# EAGLE design relay_dip_v01 (EAGLE 6.5.0)
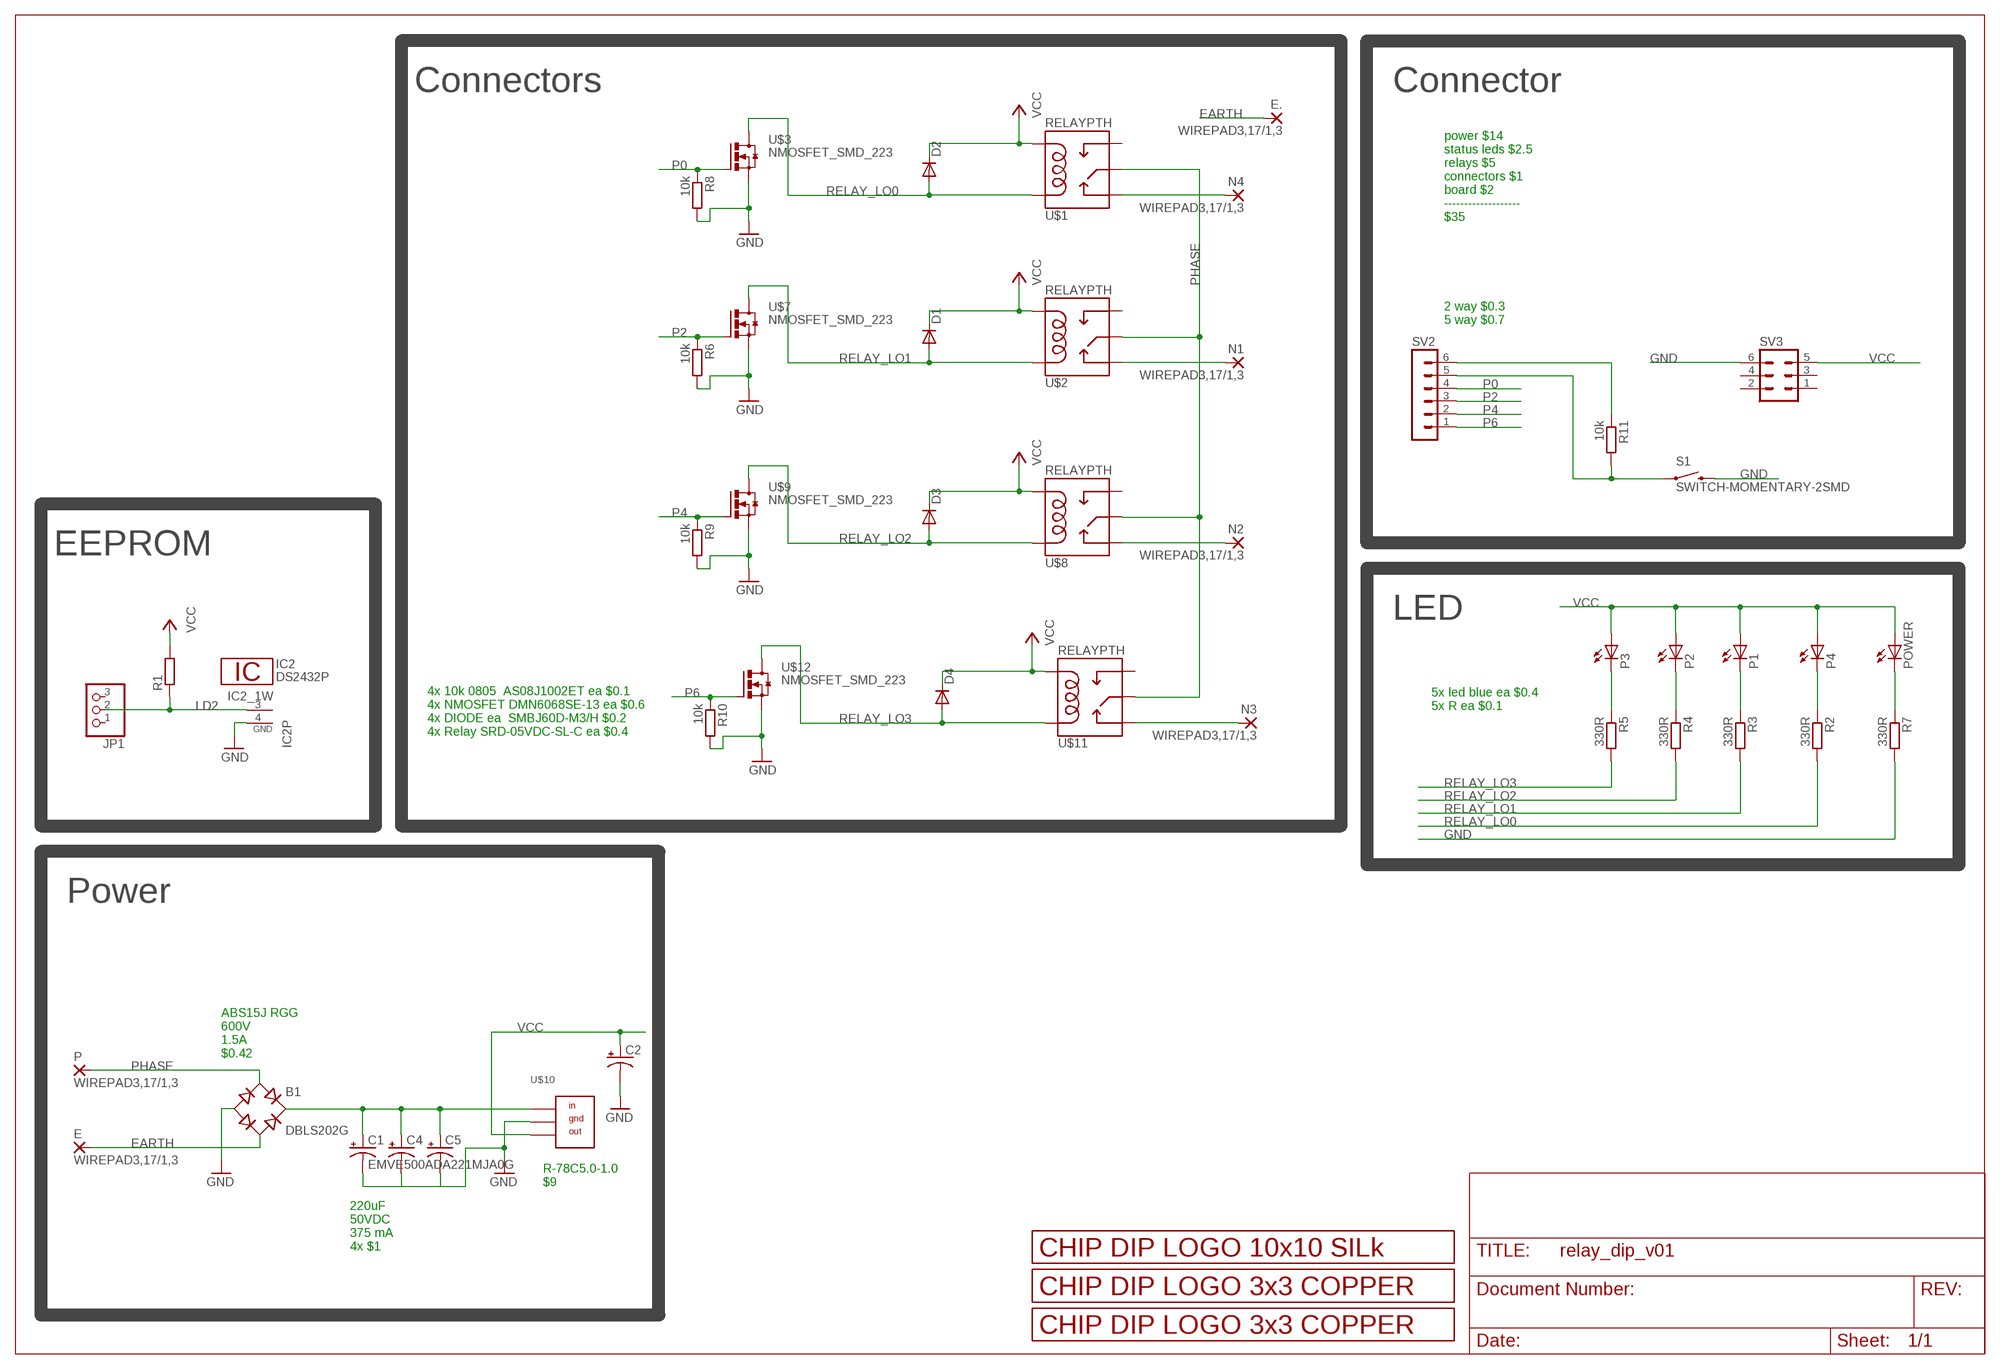
[diagram p0: schematic, sheet 1]

## Parts
B1  DBLS202G  [DBS]
C1  EMVE500ADA221MJA0G  CPOL-US150CLZ-0810  [150CLZ-0810]
C2  CPOL-US150CLZ-0810  [150CLZ-0810]
C4  CPOL-US150CLZ-0810  [150CLZ-0810]
C5  CPOL-US150CLZ-0810  [150CLZ-0810]
D1  DIODE-SMB  [SMB]
D2  DIODE-SMB  [SMB]
D3  DIODE-SMB  [SMB]
D4  DIODE-SMB  [SMB]
E  WIREPAD3,17/1,3  [3,17/1,3]
E.  WIREPAD3,17/1,3  [3,17/1,3]
IC2  DS2432P  [TSOC6]
JP1  PINHD-1X3  [1X03]
N1  WIREPAD3,17/1,3  [3,17/1,3]
N2  WIREPAD3,17/1,3  [3,17/1,3]
N3  WIREPAD3,17/1,3  [3,17/1,3]
N4  WIREPAD3,17/1,3  [3,17/1,3]
P  WIREPAD3,17/1,3  [3,17/1,3]
P1  LEDCHIP-LED0805  [CHIP-LED0805]
P2  LEDCHIP-LED0805  [CHIP-LED0805]
P3  LEDCHIP-LED0805  [CHIP-LED0805]
P4  LEDCHIP-LED0805  [CHIP-LED0805]
POWER  LEDCHIP-LED0805  [CHIP-LED0805]
R1  R-EU_R0805  [R0805]
R2  330R  R-EU_R0805  [R0805]
R3  330R  R-EU_R0805  [R0805]
R4  330R  R-EU_R0805  [R0805]
R5  330R  R-EU_R0805  [R0805]
R6  10k  R-EU_R0805  [R0805]
R7  330R  R-EU_R0805  [R0805]
R8  10k  R-EU_R0805  [R0805]
R9  10k  R-EU_R0805  [R0805]
R10  10k  R-EU_R0805  [R0805]
R11  10k  R-EU_R0805  [R0805]
S1  SWITCH-MOMENTARY-2SMD  [TACTILE-SWITCH-SMD]
SV2  MA06-1  [MA06-1]
SV3  MA03-2  [MA03-2]
U$1  RELAYPTH  [SRD-05VDC-SL-C]
U$2  RELAYPTH  [SRD-05VDC-SL-C]
U$3  NMOSFET_SMD_223  [SOT223]
U$4  LOGO_3X3_COPPER  [LOGO_3X3_COPPER]
U$5  LOGO_10X10_SILK  [LOGO_10X10_SILK]
U$6  LOGO_3X3_COPPER  [LOGO_3X3_COPPER]
U$7  NMOSFET_SMD_223  [SOT223]
U$8  RELAYPTH  [SRD-05VDC-SL-C]
U$9  NMOSFET_SMD_223  [SOT223]
U$10  R-7805-1.0  [SIP3]
U$11  RELAYPTH  [SRD-05VDC-SL-C]
U$12  NMOSFET_SMD_223  [SOT223]

## Nets
EARTH: B1.AC2 E.1(P) E..1(P)
GND: B1.- C1.- C2.- C4.- C5.- IC2.4(GND) R6.2 R7.2 R8.2 R9.2 R10.2 S1.3 SV3.6 U$3.3(S) U$7.3(S) U$9.3(S) U$10.GND U$12.3(S)
LD2: IC2.3(1W) JP1.2 R1.1
N$1: R11.2 S1.1 SV2.5
N$3: P4.C R2.1
N$4: P1.C R3.1
N$5: B1.+ C1.+ C4.+ C5.+ U$10.IN
N$6: R11.1 SV2.6
N$8: P2.C R4.1
N$10: P3.C R5.1
N$29: POWER.C R7.1
NCL: N4.1(P) U$1.SWCLOSED(SWCLOSE)
NCL1: N1.1(P) U$2.SWCLOSED(SWCLOSE)
NCL2: N2.1(P) U$8.SWCLOSED(SWCLOSE)
NCL3: N3.1(P) U$11.SWCLOSED(SWCLOSE)
P0: R8.1 SV2.4 U$3.1(G)
P2: R6.1 SV2.3 U$7.1(G)
P4: R9.1 SV2.2 U$9.1(G)
P6: R10.1 SV2.1 U$12.1(G)
PHASE: B1.AC1 P.1(P) U$1.SWCOMMON U$2.SWCOMMON U$8.SWCOMMON U$11.SWCOMMON
RELAY_LO0: D2.A R2.2 U$1.COIL1 U$3.2(D) U$3.4(D)
RELAY_LO1: D1.A R3.2 U$2.COIL1 U$7.2(D) U$7.4(D)
RELAY_LO2: D3.A R4.2 U$8.COIL1 U$9.2(D) U$9.4(D)
RELAY_LO3: D4.A R5.2 U$11.COIL1 U$12.2(D) U$12.4(D)
VCC: C2.+ D1.C D2.C D3.C D4.C P1.A P2.A P3.A P4.A POWER.A R1.2 SV3.5 U$1.COIL0 U$2.COIL0 U$8.COIL0 U$10.OUT U$11.COIL0
Unconnected: JP1.1 JP1.3 SV3.1 SV3.2 SV3.3 SV3.4 U$1.SWOPEN U$2.SWOPEN U$8.SWOPEN U$11.SWOPEN

## Notes on the sheet
- Connectors | Connector
- power $14
  status leds $2.5
  relays $5
  connectors $1
  board $2
  -------------------
  $35
- 2 way $0.3
  5 way $0.7
- EEPROM
- LED
- 5x led blue ea $0.4
  5x R ea $0.1
- 4x 10k 0805  AS08J1002ET ea $0.1
  4x NMOSFET DMN6068SE-13 ea $0.6
  4x DIODE ea  SMBJ60D-M3/H $0.2
  4x Relay SRD-05VDC-SL-C ea $0.4
- Power
- ABS15J RGG
  600V
  1.5A
  $0.42
- R-78C5.0-1.0
  $9
- 220uF
  50VDC
  375 mA
  4x $1

## Library data of the parts
B1 = rectifier:DB?*G: Single Phase 1.0 AMP Glass Passivated Bridge Rectifier Taiwan Semiconductor Co.,Ltd. - TSC Source: http://www.taiwansemi.com/TSCbig5/ezcatfiles/cust/img/img/db101g.pdf http://www.ts.com.tw/db/pictures/modules/PDT/PDT060207001/DBLS201G.pdf
C1 C2 C4 C5 = rcl:CPOL-US: POLARIZED CAPACITOR, American symbol
D1-D4 = diode:DIODE-: DIODE
E E. N1-N4 P = wirepad:WIREPAD: Wire PAD connect wire on PCB
IC2 = 1wire:DS2432: 1024-Bit Protected EEPROM with SHA-1 Engine This chip is a cryptographic device, providing 1024 Bits of EEPROM memory which may be written only after supplying the correct 64 bit secret. the secret cannot be read back from the device. The other features of this chip are like the DS2431. Please note the SHA-1 hash algorithm is considered weak if the data is not properly "padded". If you don't understand anything of this, don't use this chip. Author: Jan Kandziora <jjj@gmx.de>
JP1 = adafruit:PINHD-1X3: PIN HEADER
P1-P4 POWER = led:LED: LED OSRAM: - CHIPLED LG R971, LG N971, LY N971, LG Q971, LY Q971, LO R971, LY R971 LH N974, LH R974 LS Q976, LO Q976, LY Q976 LO Q996 - Hyper CHIPLED LW Q18S LB Q993, LB Q99A, LB R99A - SideLED LS A670, LO A670, LY A670, LG A670, LP A670 LB A673, LV A673, LT A673, LW A673 LH A674 LY A675 LS A676, LA A676, LO A676, LY A676, LW A676 LS A679, LY A679, LG A679 - Hyper Micro SIDELED® LS Y876, LA Y876, LO Y876, LY Y876 LT Y87S - SmartLED LW L88C, LW L88S LB L89C, LB L89S, LG L890 LS L89K, LO L89K, LY L89K LS L896, LA L896, LO L896, LY L896 - TOPLED LS T670, LO T670, LY T670, LG T670, LP T670 LSG T670, LSP T670, LSY T670, LOP T670, LYG T670 LG T671, LOG T671, LSG T671 LB T673, LV T673, LT T673, LW T673 LH T674 LS T676, LA T676, LO T676, LY T676, LB T676, LH T676, LSB T676, LW T676 LB T67C, LV T67C, LT T67C, LS T67K, LO T67K, LY T67K, LW E67C LS E67B, LA E67B, LO E67B, LY E67B, LB E67C, LV E67C, LT E67C LW T67C LS T679, LY T679, LG T679 LS T770, LO T770, LY T770, LG T770, LP T770 LB T773, LV T773, LT T773, LW T773 LH T774 LS E675, LA E675, LY E675, LS T675 LS T776, LA T776, LO T776, LY T776, LB T776 LHGB T686 LT T68C, LB T68C - Hyper Mini TOPLED® LB M676 - Mini TOPLED Santana® LG M470 LS M47K, LO M47K, LY M47K Source: http://www.osram.convergy.de LUXEON: - LUMILED® LXK2-PW12-R00, LXK2-PW12-S00, LXK2-PW14-U00, LXK2-PW14-V00 LXK2-PM12-R00, LXK2-PM12-S00, LXK2-PM14-U00 LXK2-PE12-Q00, LXK2-PE12-R00, LXK2-PE12-S00, LXK2-PE14-T00, LXK2-PE14-U00 LXK2-PB12-K00, LXK2-PB12-L00, LXK2-PB12-M00, LXK2-PB14-N00, LXK2-PB14-P00, LXK2-PB14-Q00 LXK2-PR12-L00, LXK2-PR12-M00, LXK2-PR14-Q00, LXK2-PR14-R00 LXK2-PD12-Q00, LXK2-PD12-R00, LXK2-PD12-S00 LXK2-PH12-R00, LXK2-PH12-S00 LXK2-PL12-P00, LXK2-PL12-Q00, LXK2-PL12-R00 Source: www.luxeon.com KINGBRIGHT: KA-3528ASYC Source: www.kingbright.com
R1-R11 = rcl:R-EU_: RESISTOR, European symbol
S1 = SparkFun-Electromechanical:SWITCH-MOMENTARY-2: Various NO switches- pushbuttons, reed, etc; PROD_ID: SWCH-08247
SV2 = con-lstb:MA06-1: PIN HEADER; OC_FARNELL: unknown; OC_NEWARK: unknown
SV3 = con-lstb:MA03-2: PIN HEADER; OC_FARNELL: unknown; OC_NEWARK: unknown
U$1 U$2 U$8 U$11 = SRD-05VDC-SL-C:RELAY: SPDT relay (COM-00101)
U$3 U$7 U$9 U$12 = transistor-power:NMOSFET_SMD_223
U$4 U$6 = logo:LOGO_3X3_COPPER
U$5 = logo:LOGO_10X10_SILK
U$10 = Kolja:R-7805-1.0

## Board
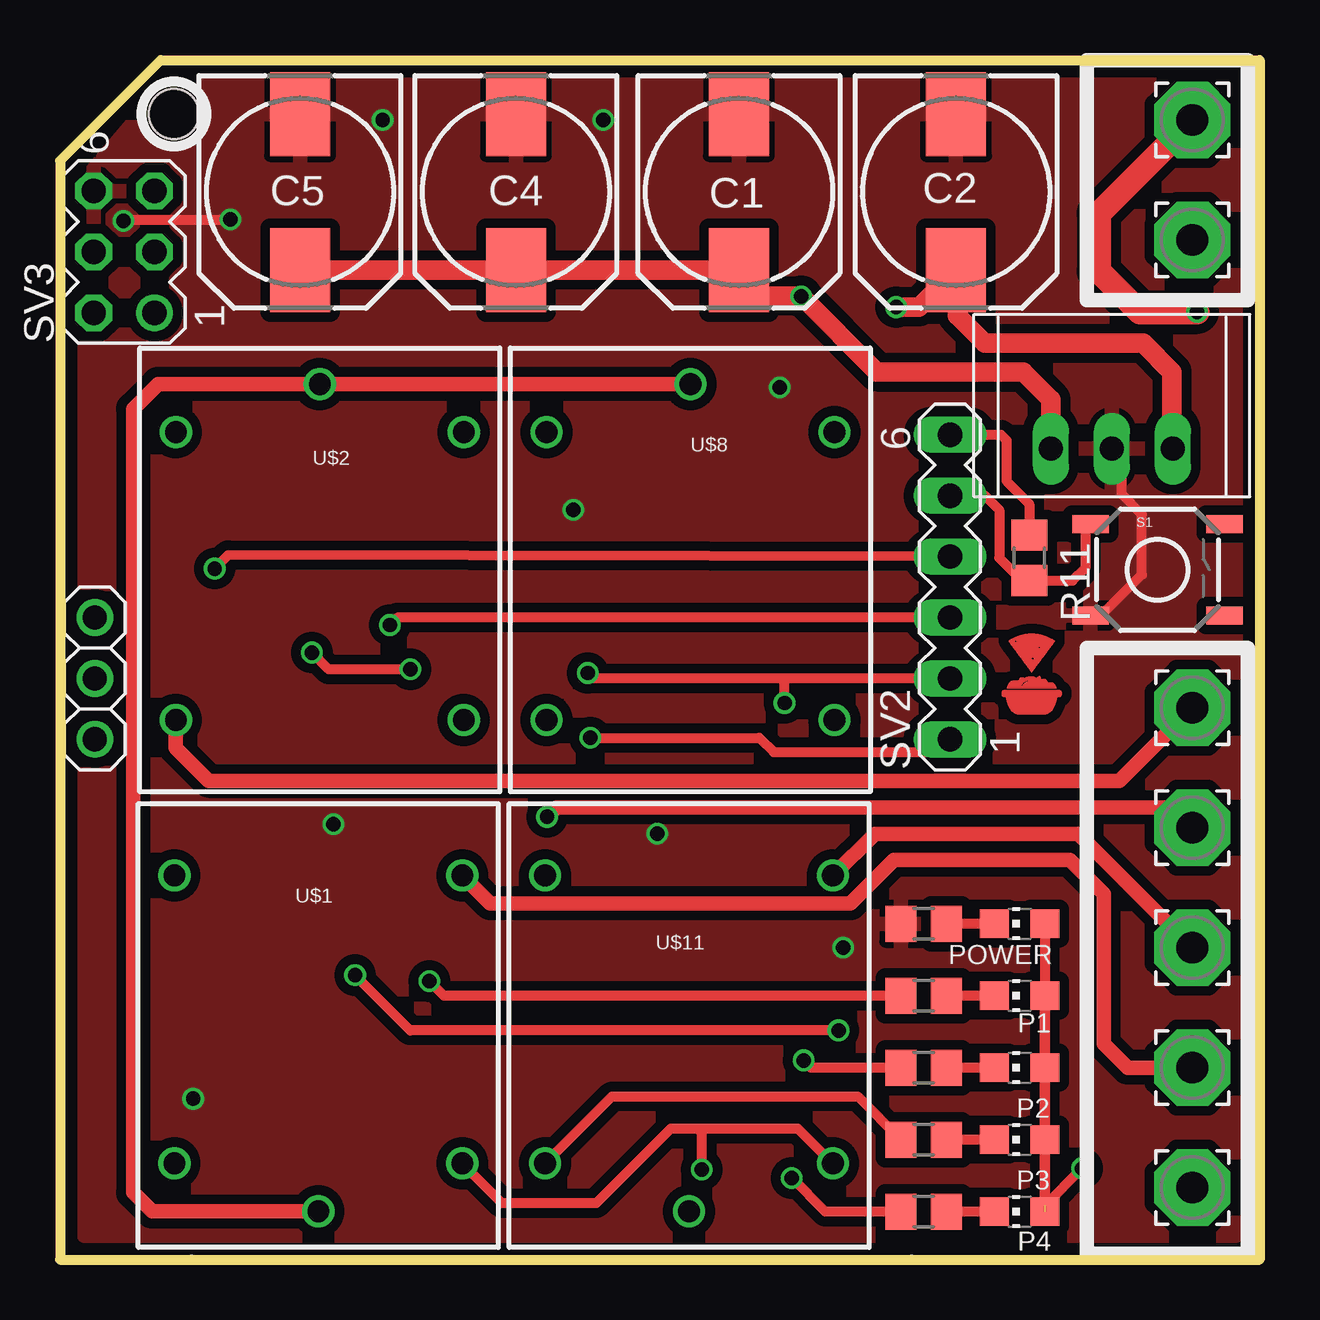
[diagram p1: board, top side]
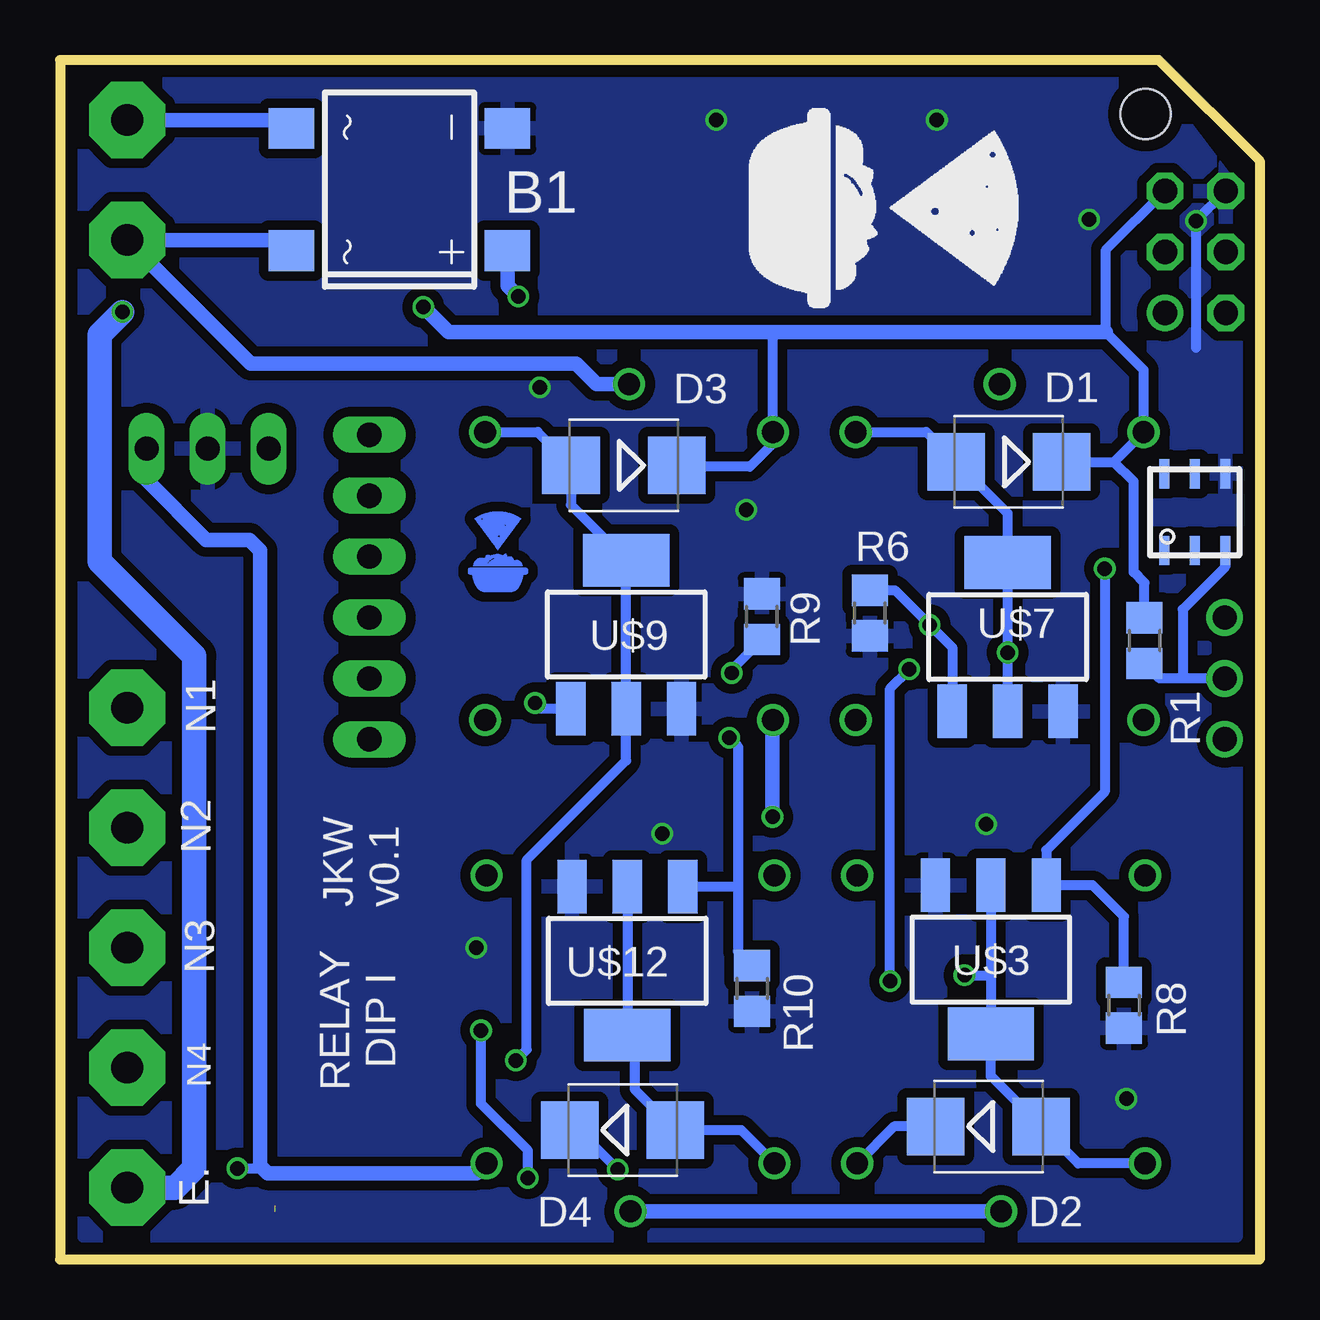
[diagram p2: board, bottom side, seen from below]

Size 50 x 50 mm. Coordinates in mm from the lower left corner, seen from the top.
Outline: 4.2,50 50,50 50,0 0,0 0,45.8 4.2,50
Copper layers (1*16): Top 0.035mm / dielectric 1.6mm / Bottom 0.035mm
Design rules "Elecrow_2-layer_PCB_eagle_rule": minimum track width 6mil, minimum drill 12mil, track to track 6mil, track to pad 6mil, pad to pad 6mil, via to via 8mil, smd to smd 0mil, copper to edge 20mil, drill to drill 10mil, minimum pad ring 6mil, minimum via ring 6mil, stop-mask expansion 0mil, vias tented up to drill 100mil, thermal gap 10mil
Holes 2.1 mm at 4.75,47.75

### Footprints (pad centres in the part's own frame; a part is rotated, then mirrored left to right if it is on the bottom)
DBS = smd 1.7 x 1.9: + -2.55,-4.5; - 2.55,-4.5; AC1 -2.55,4.5; AC2 2.55,4.5
150CLZ-0810 = smd 3.5 x 2.5: + 3.25,0; - -3.25,0
SMB = smd 2.4 x 2.4: A 2.2,0; C -2.2,0
3,17/1,3 = drill 1.321 pad 3.175 octagon: 1 0,0
TSOC6 = smd 0.406 x 1.219: 1 -1.27,-1.6; 2 0,-1.6; 3 1.27,-1.6; 4 1.27,1.6; 5 0,1.6; 6 -1.27,1.6
1X03 = drill 1.016: 1 -2.54,0; 2 0,0; 3 2.54,0
CHIP-LED0805 = smd 1.2 x 1.2: A 0,-1.05; C 0,1.05
R0805 = smd 1.3 x 1.5: 1 -0.95,0; 2 0.95,0
TACTILE-SWITCH-SMD = smd 1.524 x 0.762: 1 -2.794,1.905; 2 2.794,1.905; 3 -2.794,-1.905; 4 2.794,-1.905
MA06-1 = drill 1.016 long: 1 -6.35,0; 2 -3.81,0; 3 -1.27,0; 4 1.27,0; 5 3.81,0; 6 6.35,0
MA03-2 = drill 1.016: 1 -2.54,-1.27 | drill 1.016 octagon: 2 -2.54,1.27; 3 0,-1.27; 4 0,1.27; 5 2.54,-1.27; 6 2.54,1.27
SRD-05VDC-SL-C = drill 0.9: COIL0 -5.39,-6.12; COIL1 -5.39,5.88; SWCLOSED 6.61,-6.12; SWCOMMON -7.39,-0.12; SWOPEN 6.61,5.88
SOT223 = smd 1.219 x 2.235: 1 -2.311,-3.099; 2 0,-3.099; 3 2.311,-3.099 | smd 3.6 x 2.2: 4 0,3.099
SIP3 = drill 1 long: GND 5.75,2; IN 3.21,2; OUT 8.29,2

### Placement (x,y rotation side)
B1  35.85,44.6 90 bottom
C1  28.3,44.5 270 top
C2  37.35,44.5 270 top
C4  19,44.5 270 top
C5  10,44.5 270 top
D1  10.45,33.25 180 bottom
D2  11.3,5.55 0 bottom
D3  26.5,33.1 180 bottom
D4  26.55,5.4 0 bottom
E  47.2,47.5 90 top
E.  47.2,3 90 top
IC2  2.7,31.15 0 bottom
JP1  1.45,24.22 90 top
N1  47.2,23 0 top
N2  47.2,18 0 top
N3  47.2,13 0 top
N4  47.2,8 90 top
P  47.2,42.5 90 top
P1  40,11 90 top
P2  40,8 90 top
P3  40,5 90 top
P4  40,2 90 top
POWER  40,14 90 top
R1  4.8,25.8 90 bottom
R2  36,2 180 top
R3  36,11 180 top
R4  36,8 180 top
R5  36,5 180 top
R6  16.25,26.95 270 bottom
R7  36,14 180 top
R8  5.65,10.6 270 bottom
R9  20.75,26.8 90 bottom
R10  21.15,11.3 270 bottom
R11  40.4,29.25 270 top
S1  45.75,28.75 0 top
SV2  37.1,28.03 90 top
SV3  2.67,42 90 top
U$1  10.65,9.4 90 top
U$2  10.95,29.1 270 top
U$3  11.2,12.5 180 bottom
U$4  40.5,24.4 0 top
U$5  21.3,48 270 bottom
U$6  31.75,29.5 0 bottom
U$7  10.5,25.95 0 bottom
U$8  26.4,29.1 270 top
U$9  26.4,26.05 0 bottom
U$10  38.1,31.8 0 top
U$11  26.1,9.4 90 top
U$12  26.35,12.45 180 bottom

### Tracks (layer width: path | path; a pad name or v marks a point on that pad's centre or on a via)
EARTH  (via drill 0.6)
  Top 1.016: E.1 43.3,43.6 43.3,41.2 45,39.5 v47.4,39.5
  Bottom 0.61: E.1 40.7,47.5 B1.AC2
  Bottom 1.016: E..1 45.2,3 44.4,3.8 44.4,25.15 48.35,29.1 48.35,38.55 v47.4,39.5
GND  (via drill 0.6)
  Top 0.406: v2.65,43.3 2.69,43.25 2.79,43.35 v7.1,43.35 | S1.3 43.4,26.84 45.1,28.55 45.1,31.05 44.25,31.9 44.25,33.4 U$10.GND
  Bottom 0.406: SV3.6 v2.65,43.3 2.65,38
  other vias: 11.4,18.15 5.55,6.7 32.65,13 24.9,17.75 21.4,31.25 30,36.35 13.45,47.5 22.65,47.5
  pour Top (isolate 0.406): 1,1 1,45 4.4,49 49,49 49,1
  pour Bottom (isolate 0.406): 1,1 49,1 49,49 4.4,49 1,44.5
LD2
  Bottom 0.406: JP1.2 3.2,24.22 | 3.2,24.22 4.17,24.22 R1.1 | IC2.3 1.43,28.87 3.2,27.1 3.2,24.22
N$1
  Top 0.406: SV2.5 38.56,31.84 39.15,31.25 39.15,29.25 40.1,28.3 R11.2 42.2,28.3 42.75,28.85 42.75,30.45 S1.1
N$3
  Top 0.406: P4.C R2.1
N$4
  Top 0.406: P1.C R3.1
N$5  (via drill 0.6)
  Top 0.813: C5.+ C4.+ C1.+ 28.4,40.15 v30.9,40.15 34.05,37 40.15,37 41.31,35.84 U$10.IN
  Bottom 0.61: B1.+ 31.35,40.6 v30.9,40.15
N$6
  Top 0.406: SV2.6 39.22,34.38 39.45,34.15 39.45,32.45 40.4,31.5 R11.1
N$8
  Top 0.406: P2.C R4.1
N$10
  Top 0.406: P3.C R5.1
N$29
  Top 0.406: POWER.C R7.1
NCL
  Top 0.61: N4.1 44.5,8 43.5,9 43.5,15.25 42.1,16.65 34.75,16.65 32.95,14.85 17.93,14.85 U$1.SWCLOSED
NCL1
  Top 0.61: U$2.SWCLOSED 4.83,21.32 6.2,19.95 44.15,19.95 N1.1
NCL2  (via drill 0.6)
  Top 0.61: N2.1 46.35,18.85 20.7,18.85 v20.3,18.45
  Bottom 0.61: v20.3,18.45 20.3,22.47 U$8.SWCLOSED
NCL3
  Top 0.61: N3.1 42.45,17.75 33.96,17.75 U$11.SWCLOSED
P0  (via drill 0.6)
  Top 0.406: SV2.4 7.01,29.36 v6.45,28.8
  Bottom 0.406: v6.45,28.8 6.45,19.5 8.89,17.06 U$3.1 6.95,15.6 5.65,14.3 R8.1
P2  (via drill 0.6)
  Top 0.406: SV2.3 14.06,26.76 v13.75,26.45
  Bottom 0.406: U$7.1 12.81,25.51 v13.75,26.45 15.2,27.9 R6.1
P4  (via drill 0.6)
  Top 0.406: SV2.2 30.1,24.22 | 30.1,24.22 22.23,24.22 v22,24.45 | v30.2,23.2 30.2,24.12 30.1,24.22
  Bottom 0.406: v22,24.45 22,24.6 R9.1 | U$9.1 29.95,22.95 v30.2,23.2
P6  (via drill 0.6)
  Top 0.406: SV2.1 36.28,21.68 | 37.03,21.75 SV2.1 | v22.1,21.75 29.15,21.75 29.75,21.15 36.57,21.15 SV2.1
  Bottom 0.406: 21.75,15.5 21.75,21.4 v22.1,21.75 | 21.75,15.5 21.75,12.85 R10.1 | U$12.1 21.8,15.55 21.75,15.5
PHASE
  Top 0.61: U$2.SWCOMMON U$8.SWCOMMON 4.09,36.49 3.05,35.45 3.05,2.8 3.84,2.01 U$1.SWCOMMON
  Bottom 0.61: B1.AC1 40.8,42.5 P.1 42.05,37.35 28.5,37.35 27.64,36.49 U$8.SWCOMMON | U$1.SWCOMMON U$11.SWCOMMON
RELAY_LO0  (via drill 0.6)
  Top 0.406: R2.2 31.9,2 v30.5,3.4 | v32.45,9.55 14.6,9.55 v12.3,11.85
  Bottom 0.406: U$3.2 11.2,11.85 | 11.2,11.85 U$3.4 11.2,7.65 D2.A 7.56,4.01 U$1.COIL1 | v12.3,11.85 11.2,11.85 | v30.5,3.4 30.5,4.55 32.45,6.5 v32.45,9.55
RELAY_LO1  (via drill 0.6)
  Top 0.406: v14.6,24.6 11.2,24.6 v10.5,25.3 | R3.2 16,11 v15.4,11.6
  Bottom 0.406: U$2.COIL1 13.89,34.49 D1.A 10.5,31.1 U$7.4 v10.5,25.3 U$7.2 10.45,22.8 | v15.4,11.6 15.4,23.8 v14.6,24.6
RELAY_LO2  (via drill 0.6)
  Top 0.406: R4.2 31.3,8 v31,8.3
  Bottom 0.406: U$8.COIL1 30.09,34.49 D3.A 28.7,31.45 U$9.4 U$9.2 26.4,20.8 30.55,16.65 30.55,8.75 v31,8.3
RELAY_LO3
  Top 0.406: U$11.COIL1 23.01,6.8 33.25,6.8 R5.2
  Bottom 0.406: U$12.2 U$12.4 | U$12.4 26.35,9.2 26.05,8.9 26.05,7.1 D4.A 21.61,5.4 U$11.COIL1 | 26.7,9 U$12.4
VCC  (via drill 0.6)  (1 unrouted)
  Top 0.406: P2.A 41.05,2.25 v42.6,3.8 | POWER.A P4.A P1.A P3.A 41.4,5 | U$11.COIL0 32.19,4.01 30.75,5.45 26.6,5.45 | 26.6,5.45 25.45,5.45 22.35,2.35 18.43,2.35 U$1.COIL0 | v26.75,3.75 26.75,5.3 26.6,5.45
  Top 0.813: 37.7,39.9 C2.+ | C2.+ 37.4,40.2 37.4,39.35 38.55,38.2 45.15,38.2 46.35,37 46.35,33.84 U$10.OUT | C2.+ 35.8,39.7 v34.85,39.7
  Bottom 0.406: D3.C 24.25,33.05 21.25,33.05 20.28,34.02 U$8.COIL0 20.3,34.51 20.3,38.65 | SV3.5 6.4,42.09 6.4,38.65 4.83,37.08 U$2.COIL0 6.07,33.25 | D1.C 6.07,33.25 | v42.6,3.8 41.75,3.8 41.65,3.9 | D2.C 15.23,5.55 U$1.COIL0 | D4.C 28.4,5.4 v26.75,3.75 | R1.2 4.8,28.2 5.25,28.65 5.25,32.43 6.07,33.25
  Bottom 0.61: v34.85,39.7 33.8,38.65 20.3,38.65 6.4,38.65 | U$11.COIL0 32.63,3.6 41.35,3.6 41.65,3.9 41.65,29.55 42.1,30 43.9,30 46.39,32.49 U$10.OUT

### Text on the board
bPlace: JKW / v0.1 | RELAY / DIP I
tNames: not ordered